# EasyEDA schematic GIMEOLE X 2023.json
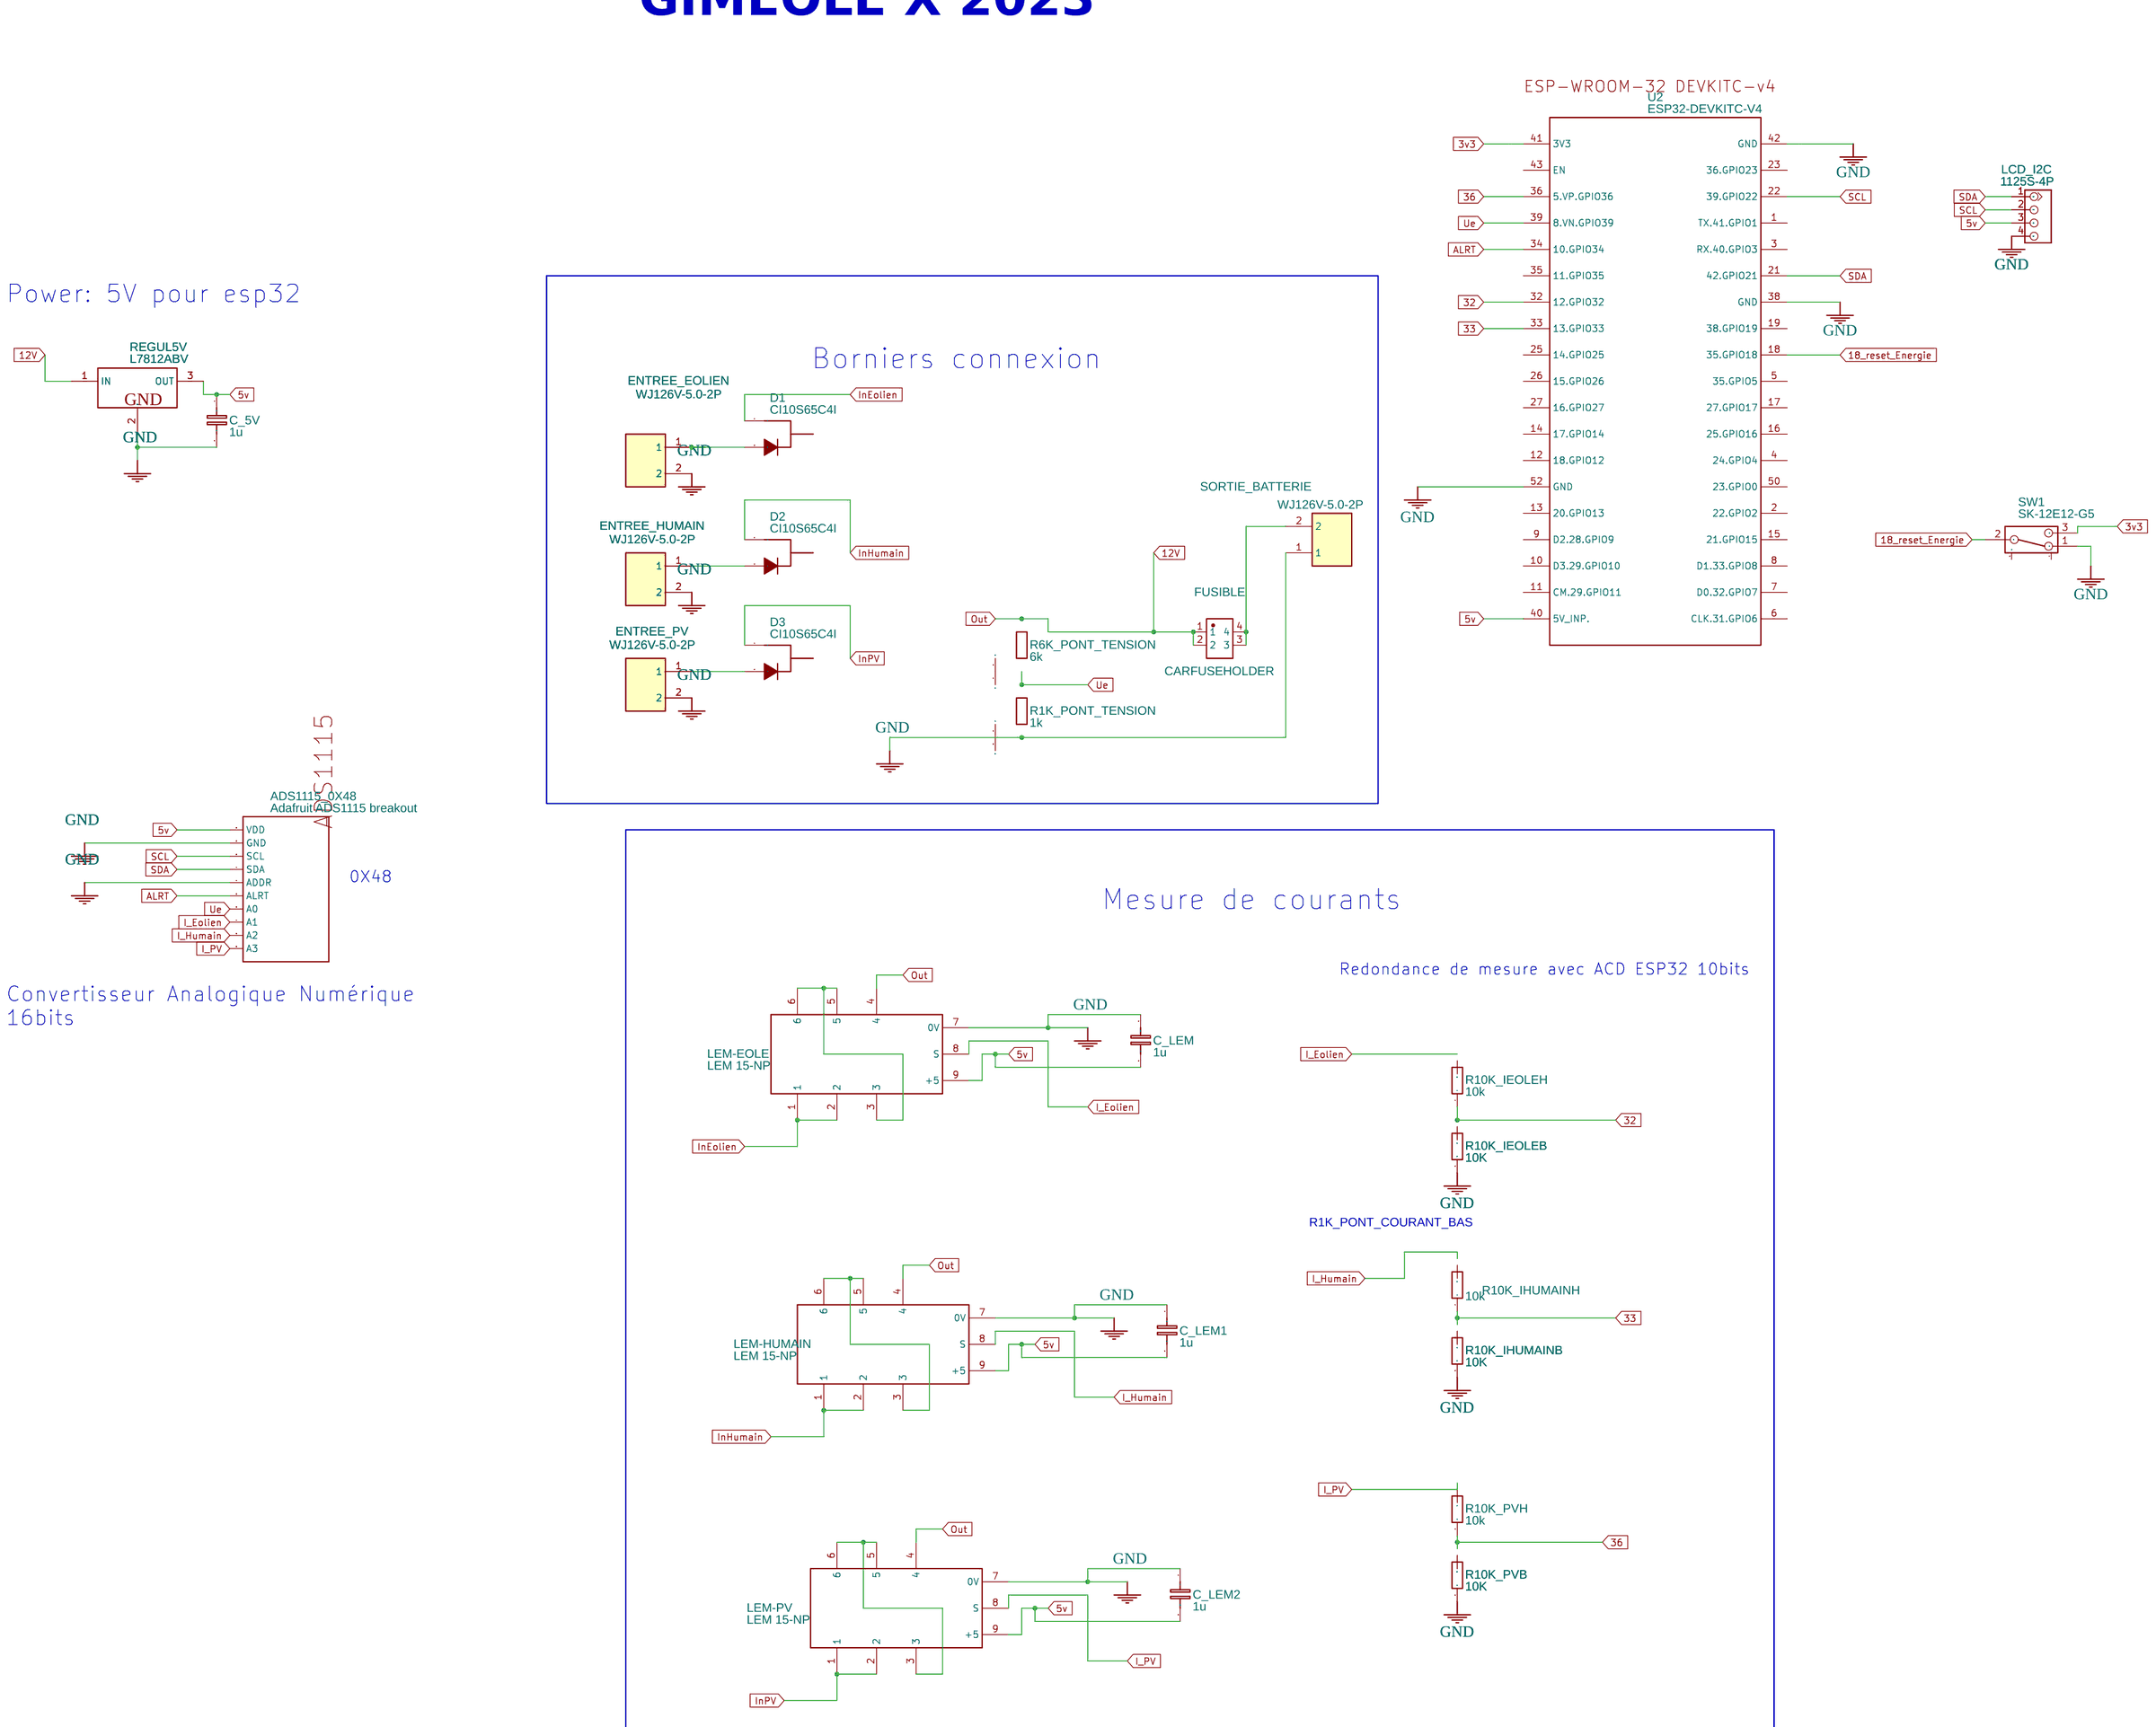
[diagram p0: schematic sheet]

## Parts
ADS1115_0X48  Adafruit ADS1115 breakout  [ADAFRUIT ADS1115]
C_5V  1u  [RAD-0.1]
C_LEM  1u  [RAD-0.1]
C_LEM1  1u  [RAD-0.1]
C_LEM2  1u  [RAD-0.1]
D1  CI10S65C4I  [TO-220-2L_L10.2-W4.6-P5.08-L]
D2  CI10S65C4I  [TO-220-2L_L10.2-W4.6-P5.08-L]
D3  CI10S65C4I  [TO-220-2L_L10.2-W4.6-P5.08-L]
ENTREE_EOLIEN  WJ126V-5.0-2P  [WJ126V-5.0-2P]
ENTREE_HUMAIN  WJ126V-5.0-2P  [WJ126V-5.0-2P]
ENTREE_PV  WJ126V-5.0-2P  [WJ126V-5.0-2P]
FUSIBLE  CARFUSEHOLDER  [CONN-TH_4P-P3.70_CARFUSEHOLDER]
LCD_I2C  1125S-4P  [HW4-2.0]
LEM-EOLE  LEM 15-NP  [LEM TEST]
LEM-HUMAIN  LEM 15-NP  [LEM TEST]
LEM-PV  LEM 15-NP  [LEM TEST]
R1K_PONT_TENSION  1k  [AXIAL-0.3]
R6K_PONT_TENSION  6k  [AXIAL-0.3]
R10K_IEOLEB  10K  [AXIAL-0.3]
R10K_IEOLEH  10k  [AXIAL-0.3]
R10K_IHUMAINB  10K  [AXIAL-0.3]
R10K_IHUMAINH  10k  [AXIAL-0.3]
R10K_PVB  10K  [AXIAL-0.3]
R10K_PVH  10k  [AXIAL-0.3]
REGUL5V  L7812ABV  [TO-220(TO-220-3)]
SORTIE_BATTERIE  WJ126V-5.0-2P  [WJ126V-5.0-2P]
SW1  SK-12E12-G5  [SW-TH_SK-12E12-G5]
U2  ESP32-DEVKITC-V4  [ESP32-DEVKITC-V4]

## Library data of the parts
ADS1115_0X48 = Adafruit ADS1115 breakout: Manufacturer: Adafruit; Manufacturer Part: 1085; link: https://www.adafruit.com/product/1085; Contributor: anthonyhorton
C_5V C_LEM C_LEM1 C_LEM2 = Capacitor: Manufacturer Part: ?
D1-D3 = CI10S65C4I: Supplier: LCSC; Supplier Part: C2842689; Manufacturer: Tokmas(托克马斯); Contributor: LCSC; JLCPCB Part Class: Extended Part
ENTREE_EOLIEN ENTREE_HUMAIN ENTREE_PV SORTIE_BATTERIE = -: Supplier: EasyEDA; Manufacturer: EasyEDA; Supplier Part: E8404
FUSIBLE = CARFUSEHOLDER: Supplier: LCSC; Supplier Part: C9900012101; Manufacturer: null; Manufacturer Part: CarFuseholder; link: https://atta.szlcsc.comnull; JLCPCB Part Class: Extended Part; Contributor: lcsc
LCD_I2C = -: DIP Grove; catid: 20; Supplier: SeeedStudio; Supplier Part: 320110033
LEM-EOLE LEM-HUMAIN LEM-PV = -: Supplier: lem; link: http://www.europowercomponents.com/media/uploads/LTS15-NP.pdf; Contributor: sroddier; Supplier Part: LEM
R1K_PONT_TENSION R6K_PONT_TENSION R10K_IEOLEB R10K_IEOLEH R10K_IHUMAINB R10K_IHUMAINH R10K_PVB R10K_PVH = Resistor: Manufacturer Part: ?
REGUL5V = -: catid: 20; Supplier: EasyEDA; Manufacturer: ST; Supplier Part: E29119
SW1 = SK-12E12-G5: Supplier: LCSC; Supplier Part: C136720; Manufacturer: Rectangular Connectors - Contacts; Contributor: LCSC
U2 = ESP32-DEVKITC-V4: Manufacturer: Espressif Systems; Manufacturer Part: ESP32-DevKitC; Supplier: Mouser; Supplier Part: 356-ESP32-DEVKITC; link: http://esp-idf.readthedocs.io/en/latest/get-started/get-started-devkitc.html; Contributor: erol erol

## Nets
3v3: SW1.3 U2.41(3V3)
5v: ADS1115_0X48.10(VDD) C_5V.1 C_LEM.2 C_LEM1.2 C_LEM2.2 LCD_I2C.3(Vcc) LEM-EOLE.9(+5) LEM-HUMAIN.9(+5) LEM-PV.9(+5) REGUL5V.3(OUT) U2.40(5V INP.)
12V: FUSIBLE.1 FUSIBLE.2 LEM-EOLE.4 LEM-HUMAIN.4 LEM-PV.4 R6K_PONT_TENSION.2 REGUL5V.1(IN)
GND: ADS1115_0X48.1(ADDR) ADS1115_0X48.9(GND) C_5V.2 C_LEM.1 C_LEM1.1 C_LEM2.1 ENTREE_EOLIEN.2 ENTREE_HUMAIN.2 ENTREE_PV.2 LCD_I2C.4(Gnd) LEM-EOLE.7(0V) LEM-HUMAIN.7(0V) LEM-PV.7(0V) R1K_PONT_TENSION.1 R10K_IEOLEB.1 R10K_IHUMAINB.1 R10K_PVB.1 REGUL5V.2(GND) SORTIE_BATTERIE.1 SW1.1 U2.38(GND) U2.42(GND) U2.52(GND)
18_reset_Energie: SW1.2 U2.18(35.GPIO18)
32: R10K_IEOLEB.2 R10K_IEOLEH.1 U2.32(12.GPIO32)
33: R10K_IHUMAINB.2 R10K_IHUMAINH.1 U2.33(13.GPIO33)
36: R10K_PVB.2 R10K_PVH.1 U2.36(5.VP.GPIO36)
ALRT: ADS1115_0X48.2(ALRT) U2.34(10.GPIO34)
I_Eolien: ADS1115_0X48.4(A1) LEM-EOLE.8(S) R10K_IEOLEH.2
I_Humain: ADS1115_0X48.5(A2) LEM-HUMAIN.8(S) R10K_IHUMAINH.2
I_PV: ADS1115_0X48.6(A3) LEM-PV.8(S) R10K_PVH.2
InEolien: D1.1 LEM-EOLE.1 LEM-EOLE.2
InHumain: D2.1 LEM-HUMAIN.1 LEM-HUMAIN.2
InPV: D3.1 LEM-PV.1 LEM-PV.2
SCL: ADS1115_0X48.8(SCL) LCD_I2C.2(Sig2) U2.22(39.GPIO22)
SDA: ADS1115_0X48.7(SDA) LCD_I2C.1(Sig1) U2.21(42.GPIO21)
Ue: ADS1115_0X48.3(A0) R1K_PONT_TENSION.2 R6K_PONT_TENSION.1 U2.39(8.VN.GPIO39)
Net-(D1-2): D1.2 ENTREE_EOLIEN.1
Net-(D2-2): D2.2 ENTREE_HUMAIN.1
Net-(D3-2): D3.2 ENTREE_PV.1
Net-(FUSIBLE-3): FUSIBLE.3 FUSIBLE.4 SORTIE_BATTERIE.2
Net-(LEM-EOLE-3): LEM-EOLE.3 LEM-EOLE.5 LEM-EOLE.6
Net-(LEM-HUMAIN-3): LEM-HUMAIN.3 LEM-HUMAIN.5 LEM-HUMAIN.6
Net-(LEM-PV-3): LEM-PV.3 LEM-PV.5 LEM-PV.6

Not connected (* = marked no-connect by the designer): SW1 4 5; U2 1(TX.41.GPIO1) 2(22.GPIO2) 3(RX.40.GPIO3) 4(24.GPIO4) 5(35.GPIO5) 6(CLK.31.GPIO6) 7(D0.32.GPIO7) 8(D1.33.GPIO8) 9(D2.28.GPIO9) 10(D3.29.GPIO10) 11(CM.29.GPIO11) 12(18.GPIO12) 13(20.GPIO13) 14(17.GPIO14) 15(21.GPIO15) 16(25.GPIO16) 17(27.GPIO17) 19(38.GPIO19) 23(36.GPIO23) 25(14.GPIO25) 26(15.GPIO26) 27(16.GPIO27) 35(11.GPIO35) 43(EN) 50(23.GPIO0)

## Notes on the sheet
- GIMEOLE X 2023
- Power: 5V pour esp32
- Borniers connexion
- 0X48
- Mesure de courants
- Redondance de mesure avec ACD ESP32 10bits
- Convertisseur Analogique Numérique
  16bits
- R1K_PONT_COURANT_BAS
